# EasyEDA schematic 1-Schematic_syntheseproject_planA_ok.json
TITLE: Plan A; REV: 1.0; Date: 2025-12-12; Sheet: 1/1; Drawn By: Ruben Van Landuyt; Company: HoGent
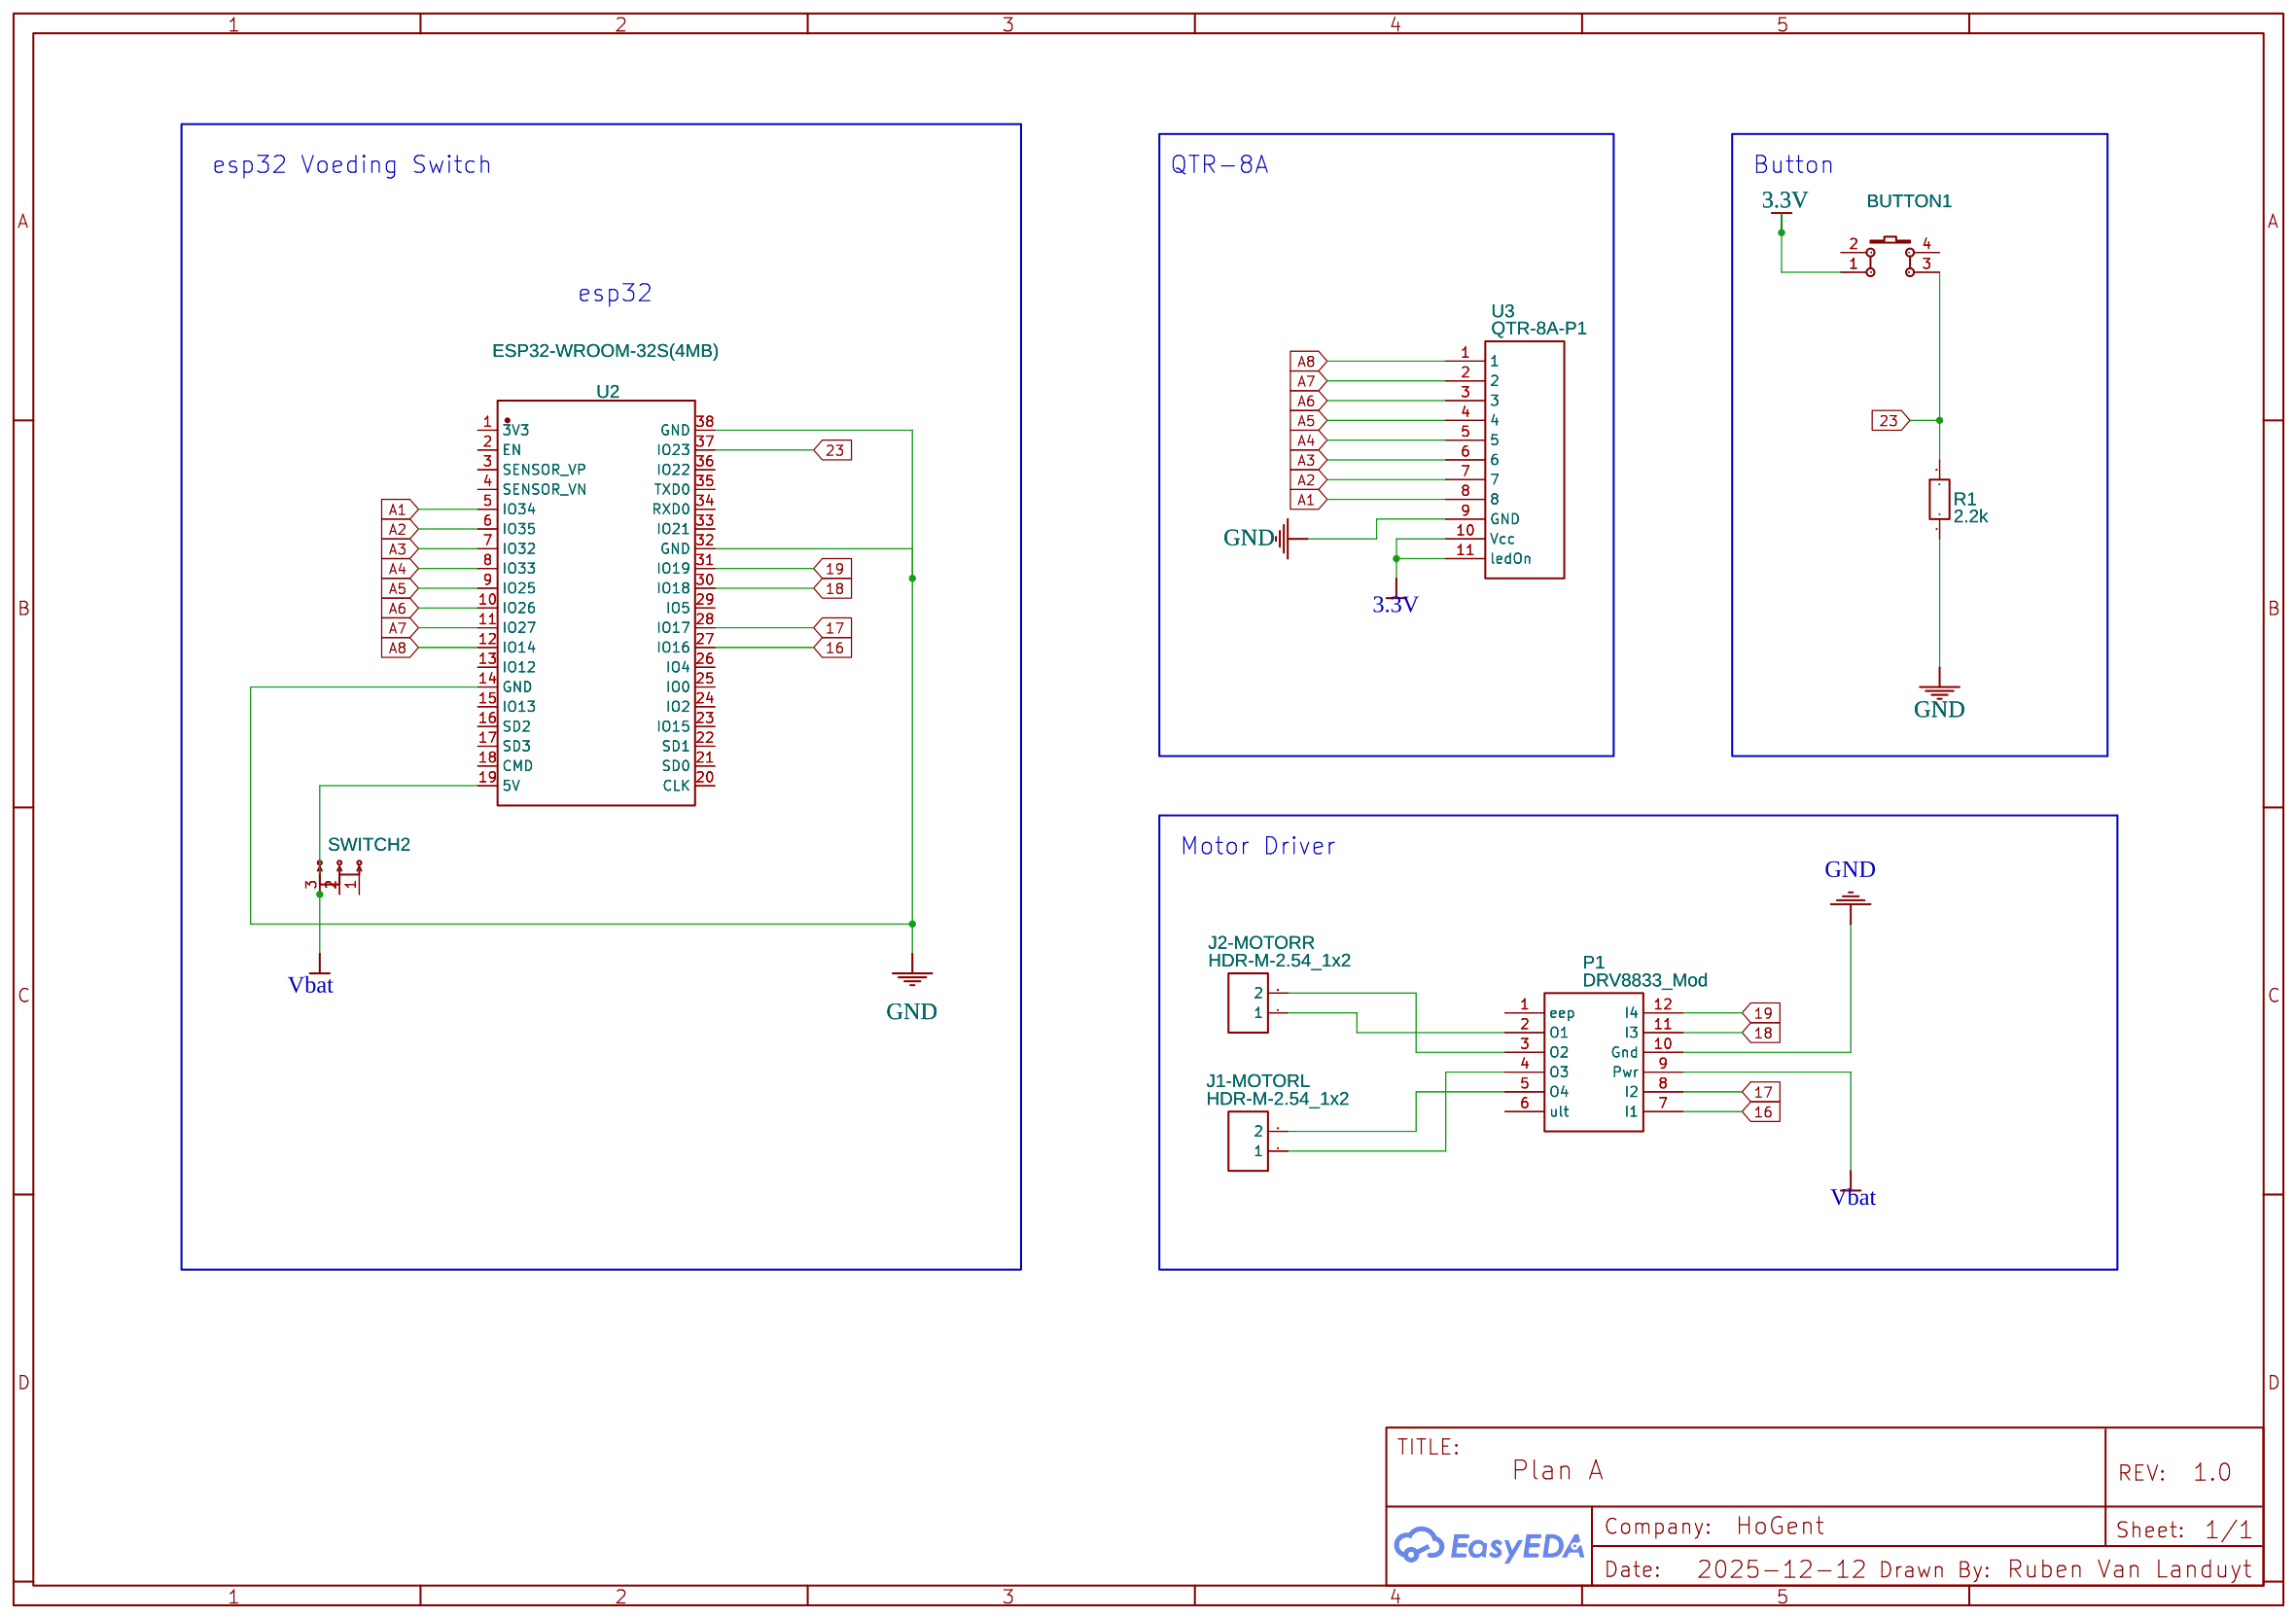
[diagram p0: schematic sheet]

## Parts
BUTTON1  K4-6×6_SMD  [KEY-SMD_4P-L6.0-W6.0-P4.50-LS8.6]
J1-MOTORL  HDR-M-2.54_1x2  [HDR-M-2.54_1X2]
J2-MOTORR  HDR-M-2.54_1x2  [HDR-M-2.54_1X2]
P1  DRV8833_Mod  [DRV8833_MOD]
R1  2.2k  [R0805]
SWITCH2  SS12D00G3_C50377147  [SW-TH_SS12D00G3]
U2  ESP32-WROOM-32S(4MB)  [WIFIM-SMD_39P-L19.2-W18.0-P1.27]
U3  QTR-8A-P1  [QTR-8A-P1]

## Library data of the parts
BUTTON1 = K4-6×6_SMD: Supplier Part: C191626; Supplier: LCSC; Manufacturer: 韩国韩荣; Manufacturer Part: K2-6639SP-D4SC-04; Contributor: LCEDA_Lib
J1-MOTORL J2-MOTORR = HDR-M-2.54_1x2: Supplier Part: C124375; Supplier: LCSC; Contributor: LCEDA_Lib
P1 = DRV8833_Mod: Contributor: Frank Cappelle
R1 = R_0805_EU: Contributor: LCEDA_Lib
SWITCH2 = SS12D00G3_C50377147: Supplier: LCSC; Supplier Part: C50377147; Manufacturer: YIZHI(逸致); Manufacturer Part: SS12D00G3; Contributor: lcsc; link: https://lcsc.com/eda_search?q=C50377147&%26type=1&ref=editor
U2 = ESP32-WROOM-32S(4MB): Supplier: LCSC; Supplier Part: C529580; Manufacturer: Espressif Systems; Contributor: Aaron Hentschel; JLCPCB Part Class: Extended Part
U3 = QTR-8A-P1: Contributor: stan_goditiabois

## Nets
3.3V: BUTTON1.1 U3.10(Vcc) U3.11(ledOn)
GND: P1.10(Gnd) R1.1 U2.14(GND) U2.32(GND) U2.38(GND) U3.9(GND)
Vbat: P1.9(Pwr) SWITCH2.3 U2.19(5V)
16: P1.7(I1) U2.27(IO16)
17: P1.8(I2) U2.28(IO17)
18: P1.11(I3) U2.30(IO18)
19: P1.12(I4) U2.31(IO19)
23: BUTTON1.3 R1.2 U2.37(IO23)
A1: U2.5(IO34) U3.8
A2: U2.6(IO35) U3.7
A3: U2.7(IO32) U3.6
A4: U2.8(IO33) U3.5
A5: U2.9(IO25) U3.4
A6: U2.10(IO26) U3.3
A7: U2.11(IO27) U3.2
A8: U2.12(IO14) U3.1
Net-(J1-MOTORL-1): J1-MOTORL.1 P1.4(O3)
Net-(J1-MOTORL-2): J1-MOTORL.2 P1.5(O4)
Net-(J2-MOTORR-1): J2-MOTORR.1 P1.2(O1)
Net-(J2-MOTORR-2): J2-MOTORR.2 P1.3(O2)

Not connected (* = marked no-connect by the designer): BUTTON1 2 4; P1 1(eep) 6(ult); SWITCH2 1 2; U2 1(3V3) 2(EN) 3(SENSOR_VP) 4(SENSOR_VN) 13(IO12) 15(IO13) 16(SD2) 17(SD3) 18(CMD) 20(CLK) 21(SD0) 22(SD1) 23(IO15) 24(IO2) 25(IO0) 26(IO4) 29(IO5) 33(IO21) 34(RXD0) 35(TXD0) 36(IO22)

## Notes on the sheet
- esp32 Voeding Switch
- QTR-8A
- Button
- esp32
- Motor Driver
